# Altium schematic sheet MCU.SchDoc
size A3
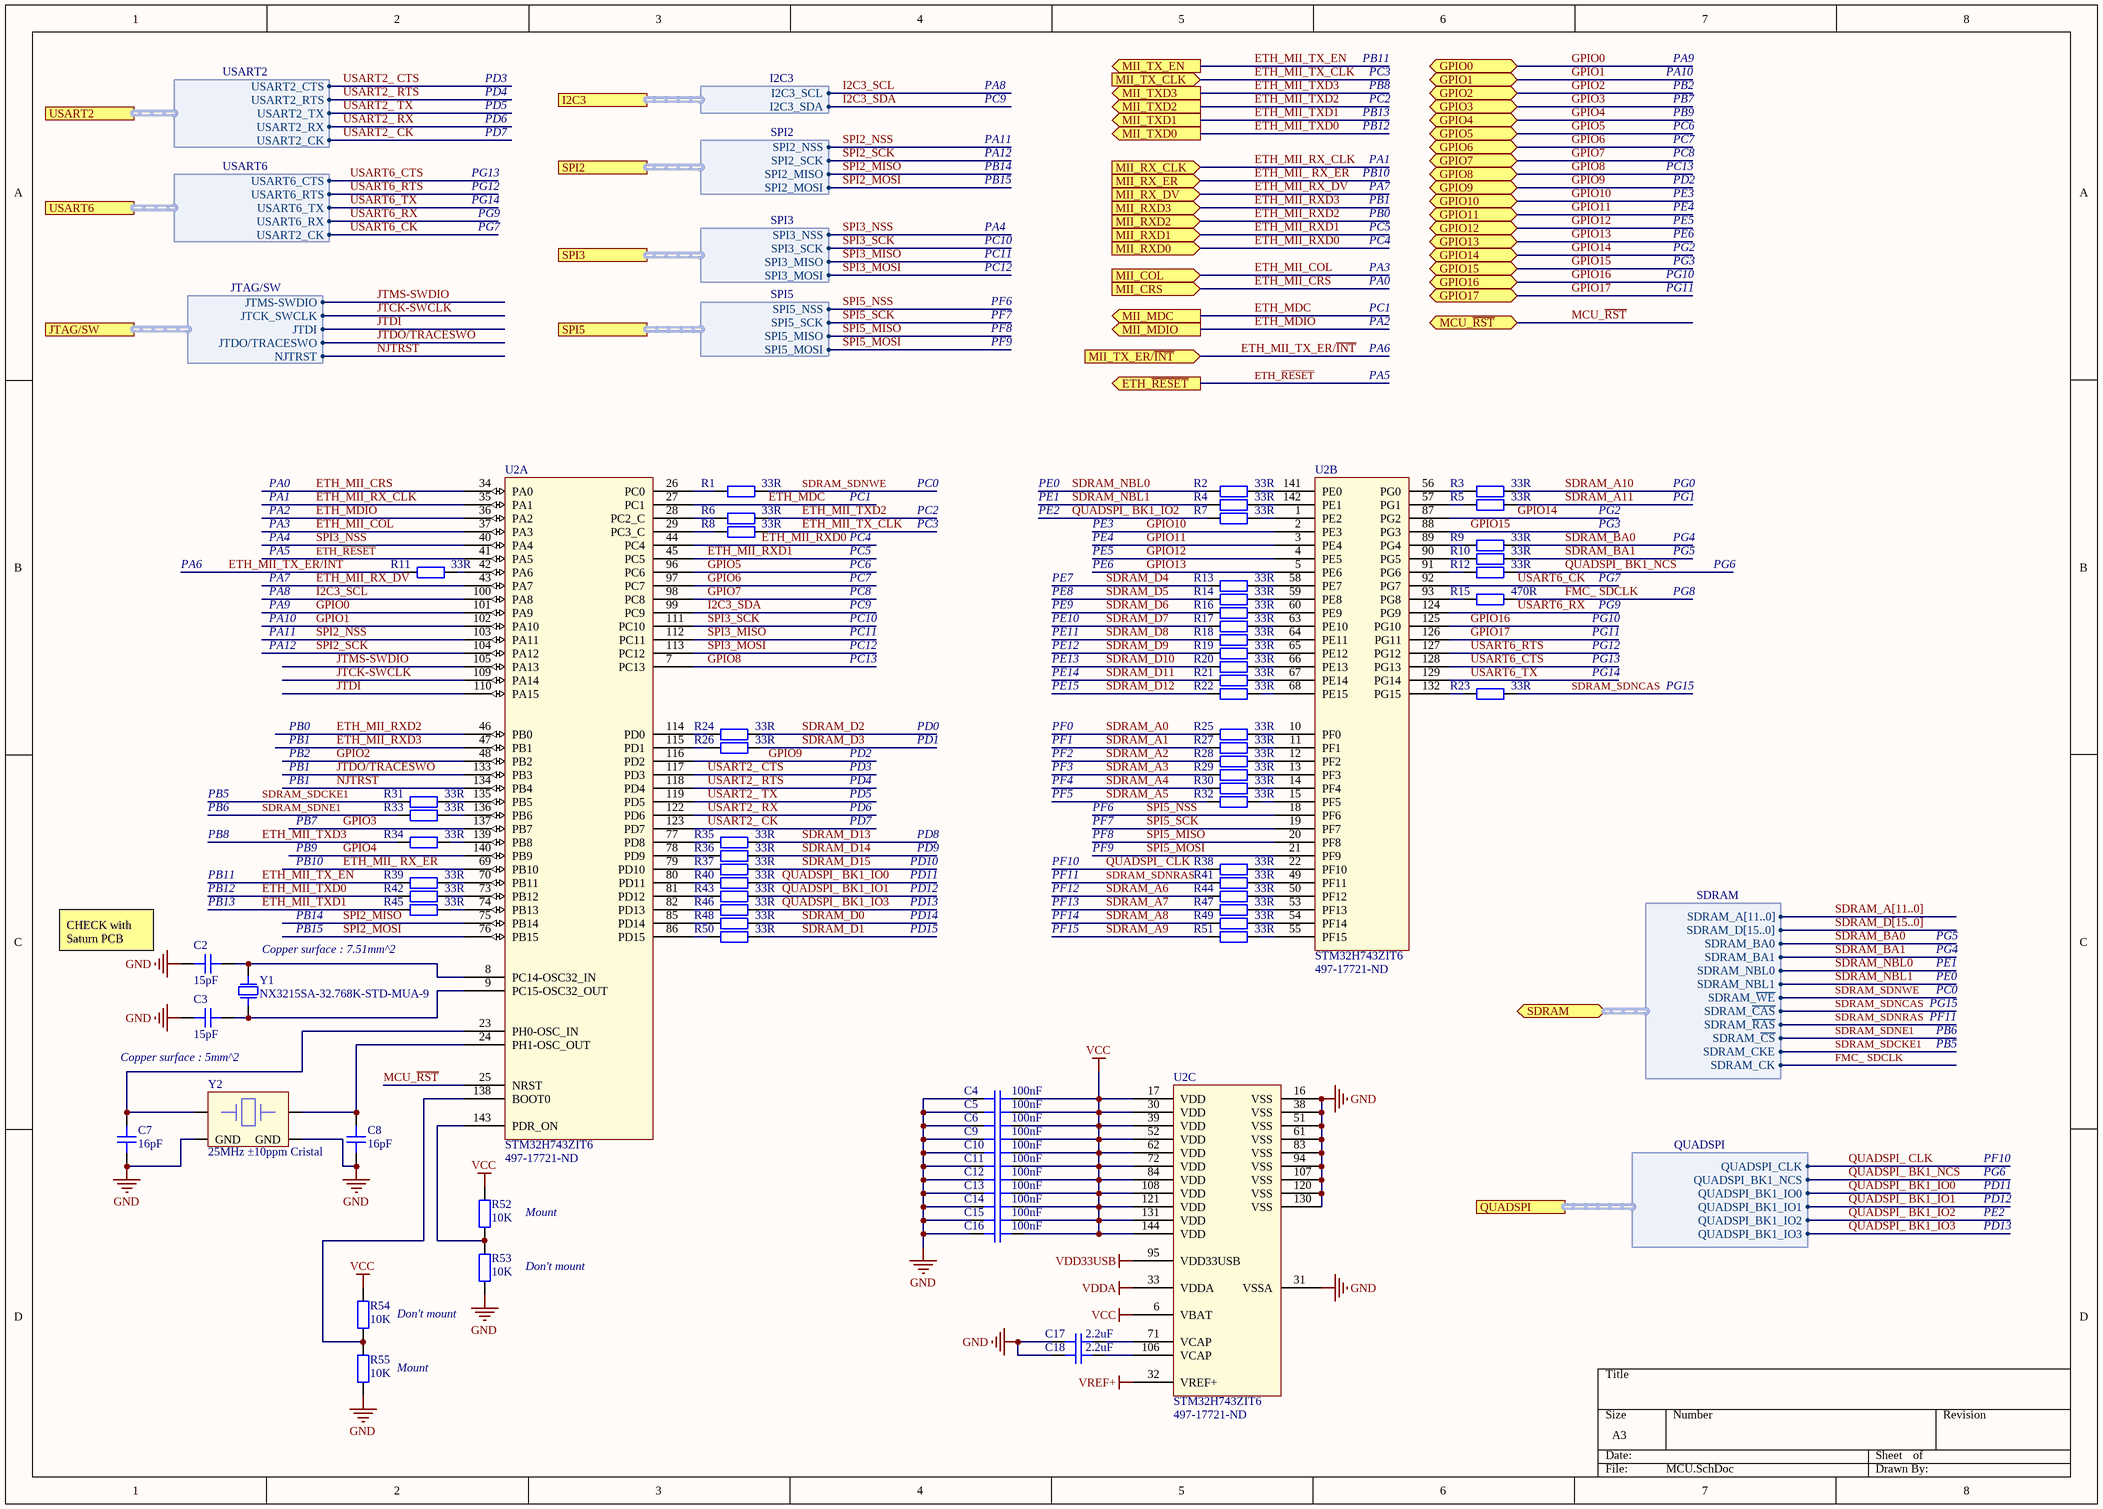
[diagram p0: MCU.SchDoc]

## Parts
C2  value 15pF  [Capacitor-0603]  (hidden comment: C-15pF-0603)
C3  value 15pF  [Capacitor-0603]  (hidden comment: C-15pF-0603)
C4  value 100nF  [Capacitor-0603]  (hidden comment: C-100nF-0603)
C5  value 100nF  [Capacitor-0603]  (hidden comment: C-100nF-0603)
C6  value 100nF  [Capacitor-0603]  (hidden comment: C-100nF-0603)
C7  value 16pF  [Capacitor-0603]  (hidden comment: C-16pF-0603)
C8  value 16pF  [Capacitor-0603]  (hidden comment: C-16pF-0603)
C9  value 100nF  [Capacitor-0603]  (hidden comment: C-100nF-0603)
C10  value 100nF  [Capacitor-0603]  (hidden comment: C-100nF-0603)
C11  value 100nF  [Capacitor-0603]  (hidden comment: C-100nF-0603)
C12  value 100nF  [Capacitor-0603]  (hidden comment: C-100nF-0603)
C13  value 100nF  [Capacitor-0603]  (hidden comment: C-100nF-0603)
C14  value 100nF  [Capacitor-0603]  (hidden comment: C-100nF-0603)
C15  value 100nF  [Capacitor-0603]  (hidden comment: C-100nF-0603)
C16  value 100nF  [Capacitor-0603]  (hidden comment: C-100nF-0603)
C17  value 2.2uF  [Capacitor-0603]  (hidden comment: C-2.2uF-0603)
C18  value 2.2uF  [Capacitor-0603]  (hidden comment: C-2.2uF-0603)
R1  value 33R  [Resistor-0603]  (hidden comment: R-33R-0603)
R2  value 33R  [Resistor-0603]  (hidden comment: R-33R-0603)
R3  value 33R  [Resistor-0603]  (hidden comment: R-33R-0603)
R4  value 33R  [Resistor-0603]  (hidden comment: R-33R-0603)
R5  value 33R  [Resistor-0603]  (hidden comment: R-33R-0603)
R6  value 33R  [Resistor-0603]  (hidden comment: R-33R-0603)
R7  value 33R  [Resistor-0603]  (hidden comment: R-33R-0603)
R8  value 33R  [Resistor-0603]  (hidden comment: R-33R-0603)
R9  value 33R  [Resistor-0603]  (hidden comment: R-33R-0603)
R10  value 33R  [Resistor-0603]  (hidden comment: R-33R-0603)
R11  value 33R  [Resistor-0603]  (hidden comment: R-33R-0603)
R12  value 33R  [Resistor-0603]  (hidden comment: R-33R-0603)
R13  value 33R  [Resistor-0603]  (hidden comment: R-33R-0603)
R14  value 33R  [Resistor-0603]  (hidden comment: R-33R-0603)
R15  value 470R  [Resistor-0603]  (hidden comment: R-470R-0603)
R16  value 33R  [Resistor-0603]  (hidden comment: R-33R-0603)
R17  value 33R  [Resistor-0603]  (hidden comment: R-33R-0603)
R18  value 33R  [Resistor-0603]  (hidden comment: R-33R-0603)
R19  value 33R  [Resistor-0603]  (hidden comment: R-33R-0603)
R20  value 33R  [Resistor-0603]  (hidden comment: R-33R-0603)
R21  value 33R  [Resistor-0603]  (hidden comment: R-33R-0603)
R22  value 33R  [Resistor-0603]  (hidden comment: R-33R-0603)
R23  value 33R  [Resistor-0603]  (hidden comment: R-33R-0603)
R24  value 33R  [Resistor-0603]  (hidden comment: R-33R-0603)
R25  value 33R  [Resistor-0603]  (hidden comment: R-33R-0603)
R26  value 33R  [Resistor-0603]  (hidden comment: R-33R-0603)
R27  value 33R  [Resistor-0603]  (hidden comment: R-33R-0603)
R28  value 33R  [Resistor-0603]  (hidden comment: R-33R-0603)
R29  value 33R  [Resistor-0603]  (hidden comment: R-33R-0603)
R30  value 33R  [Resistor-0603]  (hidden comment: R-33R-0603)
R31  value 33R  [Resistor-0603]  (hidden comment: R-33R-0603)
R32  value 33R  [Resistor-0603]  (hidden comment: R-33R-0603)
R33  value 33R  [Resistor-0603]  (hidden comment: R-33R-0603)
R34  value 33R  [Resistor-0603]  (hidden comment: R-33R-0603)
R35  value 33R  [Resistor-0603]  (hidden comment: R-33R-0603)
R36  value 33R  [Resistor-0603]  (hidden comment: R-33R-0603)
R37  value 33R  [Resistor-0603]  (hidden comment: R-33R-0603)
R38  value 33R  [Resistor-0603]  (hidden comment: R-33R-0603)
R39  value 33R  [Resistor-0603]  (hidden comment: R-33R-0603)
R40  value 33R  [Resistor-0603]  (hidden comment: R-33R-0603)
R41  value 33R  [Resistor-0603]  (hidden comment: R-33R-0603)
R42  value 33R  [Resistor-0603]  (hidden comment: R-33R-0603)
R43  value 33R  [Resistor-0603]  (hidden comment: R-33R-0603)
R44  value 33R  [Resistor-0603]  (hidden comment: R-33R-0603)
R45  value 33R  [Resistor-0603]  (hidden comment: R-33R-0603)
R46  value 33R  [Resistor-0603]  (hidden comment: R-33R-0603)
R47  value 33R  [Resistor-0603]  (hidden comment: R-33R-0603)
R48  value 33R  [Resistor-0603]  (hidden comment: R-33R-0603)
R49  value 33R  [Resistor-0603]  (hidden comment: R-33R-0603)
R50  value 33R  [Resistor-0603]  (hidden comment: R-33R-0603)
R51  value 33R  [Resistor-0603]  (hidden comment: R-33R-0603)
R52  value 10K  [Resistor-0603]  (hidden comment: R-10K-0603)
R53  value 10K  [Resistor-0603]  (hidden comment: R-10K-0603)
R54  value 10K  [Resistor-0603]  (hidden comment: R-10K-0603)
R55  value 10K  [Resistor-0603]  (hidden comment: R-10K-0603)
U2  STM32H743ZIT6  Supplier Part Number 1: 497-17721-ND  [STM32H743ZIT6]  (parts A,B,C of 3)
Y1  NX3215SA-32.768K-STD-MUA-9  [NX3215SA-32.768K-STD-MUA-9]
Y2  25MHz ±10ppm Cristal  [830107871909]

## Ports
ETH_~{RESET} (out), GPIO0 (bidir), GPIO1 (bidir), GPIO2 (bidir), GPIO3 (bidir), GPIO4 (bidir), GPIO5 (bidir), GPIO6 (bidir), GPIO7 (bidir), GPIO8 (bidir), GPIO9 (bidir), GPIO10 (bidir), GPIO11 (bidir), GPIO12 (bidir), GPIO13 (bidir), GPIO14 (bidir), GPIO15 (bidir), GPIO16 (bidir), GPIO17 (bidir), I2C3 (harness I2C3), JTAG/SW (harness JTAG/SW), MCU_~{RST} (bidir), MII_COL (in), MII_CRS (in), MII_MDC (out), MII_MDIO (out), MII_RX_CLK (in), MII_RX_DV (in), MII_RX_ER (in), MII_RXD0 (in), MII_RXD1 (in), MII_RXD2 (in), MII_RXD3 (in), MII_TX_CLK (in), MII_TX_EN (out), MII_TX_ER/~{INT} (in), MII_TXD0 (out), MII_TXD1 (out), MII_TXD2 (out), MII_TXD3 (out), QUADSPI (harness QUADSPI), SDRAM (bidir, harness SDRAM), SPI2 (harness SPI2), SPI3 (harness SPI3), SPI5 (harness SPI5), USART2 (harness USART2), USART6 (harness USART6)

## Harnesses
JTAG/SW: JTMS-SWDIO, JTCK_SWCLK, JTDI, JTDO/TRACESWO, NJTRST
USART2: USART2_CTS, USART2_RTS, USART2_TX, USART2_RX, USART2_CK
SPI3: SPI3_NSS, SPI3_SCK, SPI3_MISO, SPI3_MOSI
SPI5: SPI5_NSS, SPI5_SCK, SPI5_MISO, SPI5_MOSI
SPI2: SPI2_NSS, SPI2_SCK, SPI2_MISO, SPI2_MOSI
I2C3: I2C3_SCL, I2C3_SDA
USART6: USART6_CTS, USART6_RTS, USART6_TX, USART6_RX, USART2_CK
SDRAM: SDRAM_A[11..0], SDRAM_D[15..0], SDRAM_BA0, SDRAM_BA1, SDRAM_NBL0, SDRAM_NBL1, SDRAM_~{WE}, SDRAM_~{CAS}, SDRAM_~{RAS}, SDRAM_~{CS}, SDRAM_CKE, SDRAM_CK
QUADSPI: QUADSPI_CLK, QUADSPI_BK1_NCS, QUADSPI_BK1_IO0, QUADSPI_BK1_IO1, QUADSPI_BK1_IO2, QUADSPI_BK1_IO3

## Nets
GND: C2.1 C3.1 C4.1 C5.1 C6.1 C7.1 C8.1 C9.1 C10.1 C11.1 C12.1 C13.1 C14.1 C15.1 C16.1 C17.1 C18.1 R53.1 R55.1 U2.16(VSS) U2.31(VSSA) U2.38(VSS) U2.51(VSS) U2.61(VSS) U2.83(VSS) U2.94(VSS) U2.107(VSS) U2.120(VSS) U2.130(VSS) Y2.2(GND) Y2.4(GND)
VCC: C4.2 C5.2 C6.2 C9.2 C10.2 C11.2 C12.2 C13.2 C14.2 C15.2 C16.2 R52.2 R54.2 U2.6(VBAT) U2.17(VDD) U2.30(VDD) U2.39(VDD) U2.52(VDD) U2.62(VDD) U2.72(VDD) U2.84(VDD) U2.108(VDD) U2.121(VDD) U2.131(VDD) U2.144(VDD)
VDD33USB: U2.95(VDD33USB)
VDDA: U2.33(VDDA)
VREF+: U2.32(VREF+)
ETH_MDC: U2.27(PC1) ; port MII_MDC
ETH_MDIO: U2.36(PA2) ; port MII_MDIO
ETH_MII_ RX_ER: U2.69(PB10) ; port MII_RX_ER
ETH_MII_COL: U2.37(PA3) ; port MII_COL
ETH_MII_CRS: U2.34(PA0) ; port MII_CRS
ETH_MII_RX_CLK: U2.35(PA1) ; port MII_RX_CLK
ETH_MII_RX_DV: U2.43(PA7) ; port MII_RX_DV
ETH_MII_RXD0: U2.44(PC4) ; port MII_RXD0
ETH_MII_RXD1: U2.45(PC5) ; port MII_RXD1
ETH_MII_RXD2: U2.46(PB0) ; port MII_RXD2
ETH_MII_RXD3: U2.47(PB1) ; port MII_RXD3
ETH_MII_TX_CLK: R8.2 ; port MII_TX_CLK
ETH_MII_TX_EN: R39.1 ; port MII_TX_EN
ETH_MII_TX_ER/~{INT}: R11.1 ; port MII_TX_ER/~{INT}
ETH_MII_TXD0: R42.1 ; port MII_TXD0
ETH_MII_TXD1: R45.1 ; port MII_TXD1
ETH_MII_TXD2: R6.2 ; port MII_TXD2
ETH_MII_TXD3: R34.1 ; port MII_TXD3
ETH_~{RESET}: U2.41(PA5) ; port ETH_~{RESET}
FMC_ SDCLK: R15.2 ; port SDRAM.SDRAM_CK
GPIO0: U2.101(PA9) ; port GPIO0
GPIO1: U2.102(PA10) ; port GPIO1
GPIO2: U2.48(PB2) ; port GPIO2
GPIO3: U2.137(PB7) ; port GPIO3
GPIO4: U2.140(PB9) ; port GPIO4
GPIO5: U2.96(PC6) ; port GPIO5
GPIO6: U2.97(PC7) ; port GPIO6
GPIO7: U2.98(PC8) ; port GPIO7
GPIO8: U2.7(PC13) ; port GPIO8
GPIO9: U2.116(PD2) ; port GPIO9
GPIO10: U2.2(PE3) ; port GPIO10
GPIO11: U2.3(PE4) ; port GPIO11
GPIO12: U2.4(PE5) ; port GPIO12
GPIO13: U2.5(PE6) ; port GPIO13
GPIO14: U2.87(PG2) ; port GPIO14
GPIO15: U2.88(PG3) ; port GPIO15
GPIO16: U2.125(PG10) ; port GPIO16
GPIO17: U2.126(PG11) ; port GPIO17
I2C3_SCL: U2.100(PA8) ; port I2C3.I2C3_SCL
I2C3_SDA: U2.99(PC9) ; port I2C3.I2C3_SDA
JTCK-SWCLK: U2.109(PA14) ; port JTAG/SW.JTCK_SWCLK
JTDI: U2.110(PA15) ; port JTAG/SW.JTDI
JTDO/TRACESWO: U2.133(PB3) ; port JTAG/SW.JTDO/TRACESWO
JTMS-SWDIO: U2.105(PA13) ; port JTAG/SW.JTMS-SWDIO
MCU_~{RST}: U2.25(NRST) ; port MCU_~{RST}
NJTRST: U2.134(PB4) ; port JTAG/SW.NJTRST
QUADSPI_ BK1_IO0: R40.2 ; port QUADSPI.QUADSPI_BK1_IO0
QUADSPI_ BK1_IO1: R43.2 ; port QUADSPI.QUADSPI_BK1_IO1
QUADSPI_ BK1_IO2: R7.1 ; port QUADSPI.QUADSPI_BK1_IO2
QUADSPI_ BK1_IO3: R46.2 ; port QUADSPI.QUADSPI_BK1_IO3
QUADSPI_ BK1_NCS: R12.2 ; port QUADSPI.QUADSPI_BK1_NCS
QUADSPI_ CLK: R38.1 ; port QUADSPI.QUADSPI_CLK
SDRAM_A0: R25.1
SDRAM_A1: R27.1
SDRAM_A2: R28.1
SDRAM_A3: R29.1
SDRAM_A4: R30.1
SDRAM_A5: R32.1
SDRAM_A6: R44.1
SDRAM_A7: R47.1
SDRAM_A8: R49.1
SDRAM_A9: R51.1
SDRAM_A10: R3.2
SDRAM_A11: R5.2
SDRAM_BA0: R9.2 ; port SDRAM.SDRAM_BA0
SDRAM_BA1: R10.2 ; port SDRAM.SDRAM_BA1
SDRAM_D0: R48.2
SDRAM_D1: R50.2
SDRAM_D2: R24.2
SDRAM_D3: R26.2
SDRAM_D4: R13.1
SDRAM_D5: R14.1
SDRAM_D6: R16.1
SDRAM_D7: R17.1
SDRAM_D8: R18.1
SDRAM_D9: R19.1
SDRAM_D10: R20.1
SDRAM_D11: R21.1
SDRAM_D12: R22.1
SDRAM_D13: R35.2
SDRAM_D14: R36.2
SDRAM_D15: R37.2
SDRAM_NBL0: R2.1 ; port SDRAM.SDRAM_NBL0
SDRAM_NBL1: R4.1 ; port SDRAM.SDRAM_NBL1
SDRAM_SDCKE1: R31.1 ; port SDRAM.SDRAM_CKE
SDRAM_SDNCAS: R23.2 ; port SDRAM.SDRAM_~{CAS}
SDRAM_SDNE1: R33.1 ; port SDRAM.SDRAM_~{CS}
SDRAM_SDNRAS: R41.1 ; port SDRAM.SDRAM_~{RAS}
SDRAM_SDNWE: R1.2 ; port SDRAM.SDRAM_~{WE}
SPI2_MISO: U2.75(PB14) ; port SPI2.SPI2_MISO
SPI2_MOSI: U2.76(PB15) ; port SPI2.SPI2_MOSI
SPI2_NSS: U2.103(PA11) ; port SPI2.SPI2_NSS
SPI2_SCK: U2.104(PA12) ; port SPI2.SPI2_SCK
SPI3_MISO: U2.112(PC11) ; port SPI3.SPI3_MISO
SPI3_MOSI: U2.113(PC12) ; port SPI3.SPI3_MOSI
SPI3_NSS: U2.40(PA4) ; port SPI3.SPI3_NSS
SPI3_SCK: U2.111(PC10) ; port SPI3.SPI3_SCK
SPI5_MISO: U2.20(PF8) ; port SPI5.SPI5_MISO
SPI5_MOSI: U2.21(PF9) ; port SPI5.SPI5_MOSI
SPI5_NSS: U2.18(PF6) ; port SPI5.SPI5_NSS
SPI5_SCK: U2.19(PF7) ; port SPI5.SPI5_SCK
USART2_ CK: U2.123(PD7) ; port USART2.USART2_CK
USART2_ CTS: U2.117(PD3) ; port USART2.USART2_CTS
USART2_ RTS: U2.118(PD4) ; port USART2.USART2_RTS
USART2_ RX: U2.122(PD6) ; port USART2.USART2_RX
USART2_ TX: U2.119(PD5) ; port USART2.USART2_TX
USART6_CK: U2.92(PG7) ; port USART6.USART2_CK
USART6_CTS: U2.128(PG13) ; port USART6.USART6_CTS
USART6_RTS: U2.127(PG12) ; port USART6.USART6_RTS
USART6_RX: U2.124(PG9) ; port USART6.USART6_RX
USART6_TX: U2.129(PG14) ; port USART6.USART6_TX
NetC2_2: C2.2 U2.8(PC14-OSC32_IN) Y1.2
NetC3_2: C3.2 U2.9(PC15-OSC32_OUT) Y1.1
NetC7_2: C7.2 U2.23(PH0-OSC_IN) Y2.1(GND)
NetC8_2: C8.2 U2.24(PH1-OSC_OUT) Y2.3(XTAL2)
NetC17_2: C17.2 U2.71(VCAP)
NetC18_2: C18.2 U2.106(VCAP)
NetR1_1: R1.1 U2.26(PC0)
NetR2_2: R2.2 U2.141(PE0)
NetR3_1: R3.1 U2.56(PG0)
NetR4_2: R4.2 U2.142(PE1)
NetR5_1: R5.1 U2.57(PG1)
NetR6_1: R6.1 U2.28(PC2_C)
NetR7_2: R7.2 U2.1(PE2)
NetR8_1: R8.1 U2.29(PC3_C)
NetR9_1: R9.1 U2.89(PG4)
NetR10_1: R10.1 U2.90(PG5)
NetR11_2: R11.2 U2.42(PA6)
NetR12_1: R12.1 U2.91(PG6)
NetR13_2: R13.2 U2.58(PE7)
NetR14_2: R14.2 U2.59(PE8)
NetR15_1: R15.1 U2.93(PG8)
NetR16_2: R16.2 U2.60(PE9)
NetR17_2: R17.2 U2.63(PE10)
NetR18_2: R18.2 U2.64(PE11)
NetR19_2: R19.2 U2.65(PE12)
NetR20_2: R20.2 U2.66(PE13)
NetR21_2: R21.2 U2.67(PE14)
NetR22_2: R22.2 U2.68(PE15)
NetR23_1: R23.1 U2.132(PG15)
NetR24_1: R24.1 U2.114(PD0)
NetR25_2: R25.2 U2.10(PF0)
NetR26_1: R26.1 U2.115(PD1)
NetR27_2: R27.2 U2.11(PF1)
NetR28_2: R28.2 U2.12(PF2)
NetR29_2: R29.2 U2.13(PF3)
NetR30_2: R30.2 U2.14(PF4)
NetR31_2: R31.2 U2.135(PB5)
NetR32_2: R32.2 U2.15(PF5)
NetR33_2: R33.2 U2.136(PB6)
NetR34_2: R34.2 U2.139(PB8)
NetR35_1: R35.1 U2.77(PD8)
NetR36_1: R36.1 U2.78(PD9)
NetR37_1: R37.1 U2.79(PD10)
NetR38_2: R38.2 U2.22(PF10)
NetR39_2: R39.2 U2.70(PB11)
NetR40_1: R40.1 U2.80(PD11)
NetR41_2: R41.2 U2.49(PF11)
NetR42_2: R42.2 U2.73(PB12)
NetR43_1: R43.1 U2.81(PD12)
NetR44_2: R44.2 U2.50(PF12)
NetR45_2: R45.2 U2.74(PB13)
NetR46_1: R46.1 U2.82(PD13)
NetR47_2: R47.2 U2.53(PF13)
NetR48_1: R48.1 U2.85(PD14)
NetR49_2: R49.2 U2.54(PF14)
NetR50_1: R50.1 U2.86(PD15)
NetR51_2: R51.2 U2.55(PF15)
NetR52_1: R52.1 R53.2 U2.143(PDR_ON)
NetR54_1: R54.1 R55.2 U2.138(BOOT0)

## Buses and harness runs
bus SDRAM_A[11..0]
bus SDRAM_D[15..0]

## Notes on the sheet
- PD3
- PD4
- PD5
- PC9
- PA8
- PB11
- PB8
- PC3
- PC2
- PA10
- PA9
- PB7
- PB2
- PG13
- PD6
- PD7
- PB14
- PB15
- PA11
- PA12
- PB12
- PB13
- PB10
- PA1
- PC13
- PB9
- PC6
- PC7
- PC8
- PD2
- PG12
- PG14
- PG9
- PG7
- PC10
- PA4
- PA7
- PB1
- PB0
- PC5
- PC4
- PE4
- PE5
- PE6
- PE3
- PC11
- PC12
- PF6
- PF7
- PC1
- PA0
- PA3
- PG10
- PG11
- PG2
- PG3
- PF8
- PF9
- PA6
- PA5
- PA2
- PC0
- PE1
- PE0
- PE2
- PG1
- PG0
- PE7
- PG5
- PG4
- PG6
- PE12
- PE11
- PE10
- PE9
- PE8
- PG8
- PE15
- PE14
- PE13
- PG15
- PD1
- PD0
- PF4
- PF3
- PF2
- PF1
- PF0
- PB6
- PB5
- PD9
- PD8
- PF5
- PD10
- PD14
- PD13
- PD11
- PD12
- PF14
- PF13
- PF12
- PF11
- PF10
- (near C2) CHECK with Saturn PCB
- Copper surface : 7.51mm^2
- PD15
- PF15
- Copper surface : 5mm^2
- Mount
- Don't mount

## Library data of the parts
Y2 = 830107871909
C2 C3 = C-15pF-0603: Supplier 1: Digi-Key; Supplier Part Number 1: 399-C0603C150J5GAC7411CT-ND
C4-C6 C9-C16 = C-100nF-0603: Supplier 1: Digi-Key; Supplier Part Number 1: 1276-1006-1-ND
C7 C8 = C-16pF-0603: Supplier 1: Digi-Key; Supplier Part Number 1: 311-3964-1-ND
C17 C18 = C-2.2uF-0603: Supplier 1: Digi-Key; Supplier Part Number 1: 1276-1085-1-ND
R1-R14 R16-R51 = R-33R-0603: Supplier 1: Digi-Key; Supplier Part Number 1: RMCF0603FT33R0CT-ND
R15 = R-470R-0603: Supplier 1: Digi-Key; Supplier Part Number 1: 311-470HRCT-ND
R52-R55 = R-10K-0603: Supplier 1: Digi-Key; Supplier Part Number 1: 311-10.0KHRCT-ND
U2 = STM32H743ZIT6: Supplier 1: Digi-Key
Y1 = NX3215SA-32.768K-STD-MUA-9: Supplier 1: Digi-Key; Supplier Part Number 1: 644-1155-1-ND